# EAGLE design display_test_backup2 (EAGLE 8.1.1)
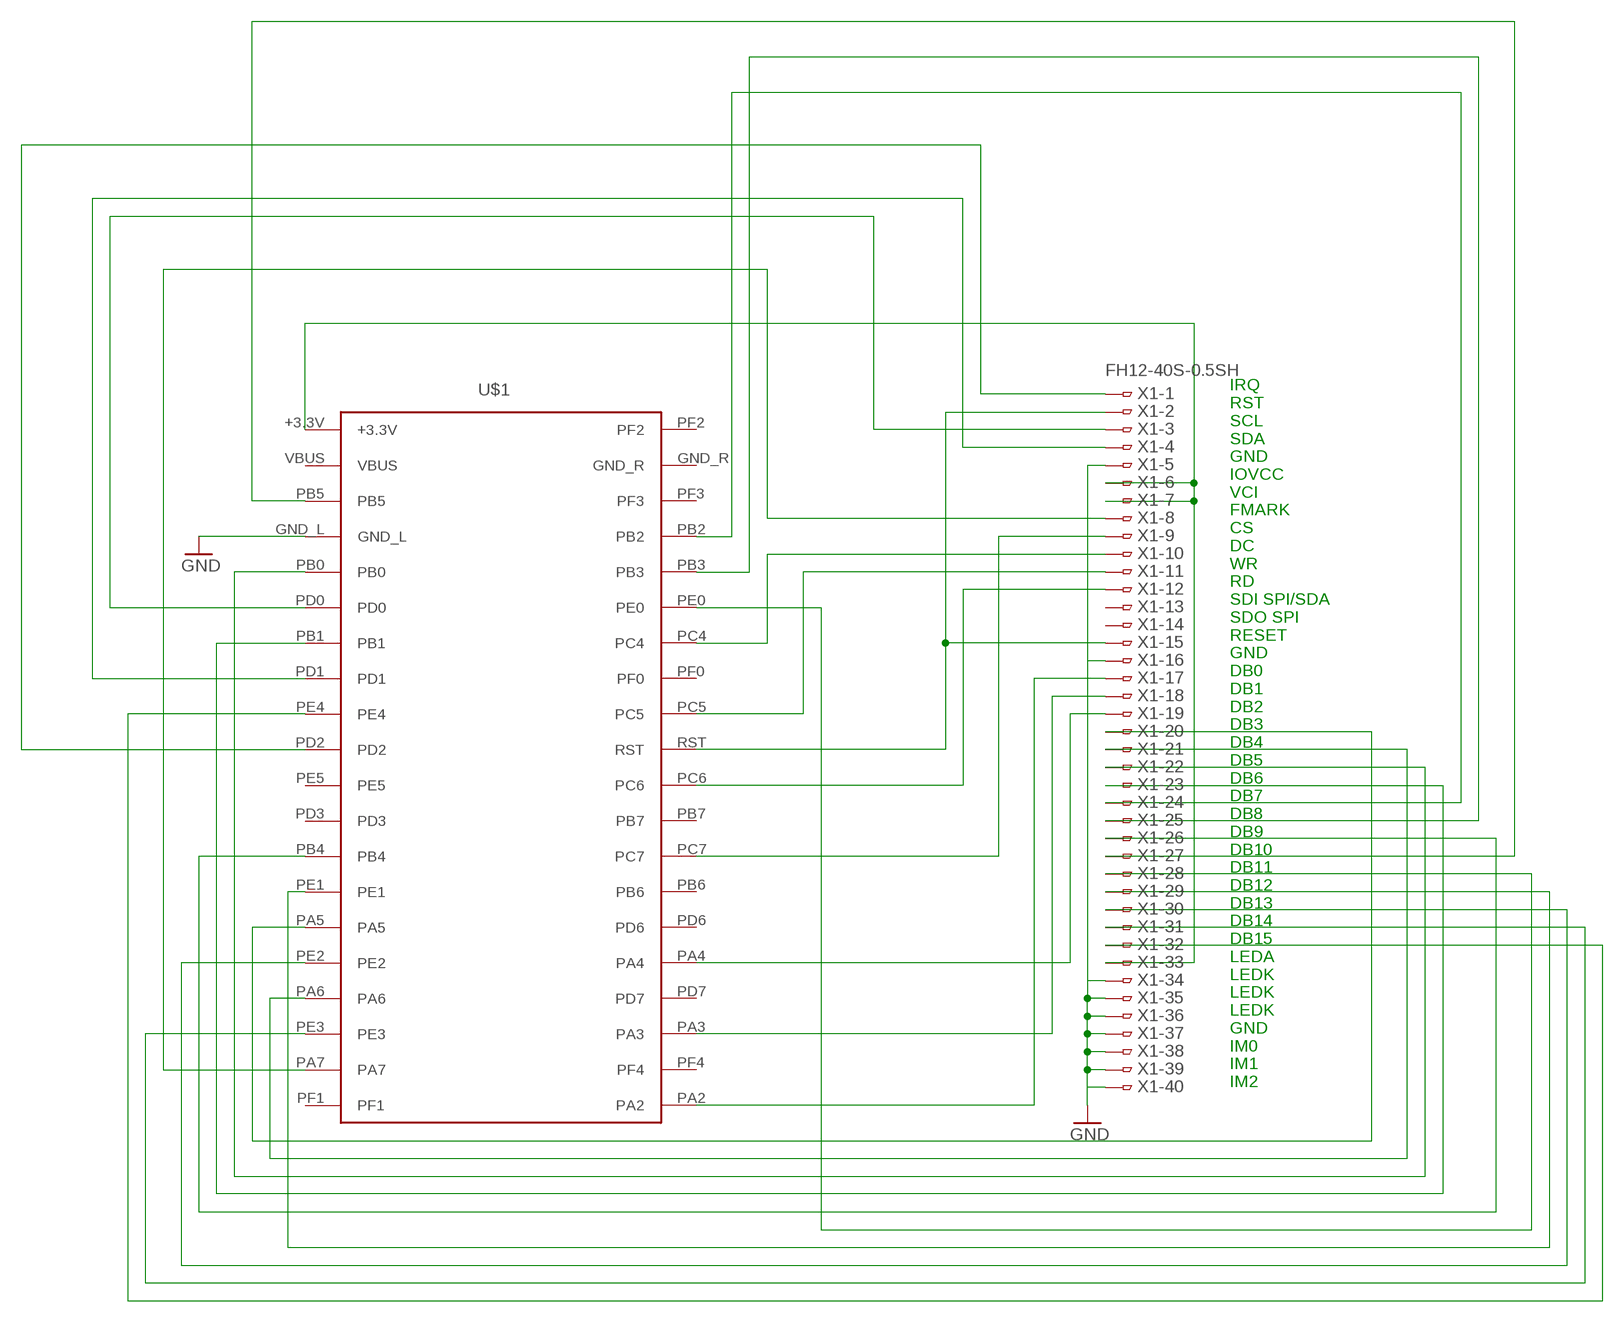
[diagram p0: schematic, sheet 1]

## Parts
U$1  TM4CTM4C  [1_05X2MM]
X1  FH12-40S-0.5SH  [FH12-40S-0.5SH]

## Nets
GND: U$1.GND_L X1.5 X1.16 X1.34 X1.35 X1.36 X1.37 X1.38 X1.39 X1.40
N$1: U$1.+3.3V X1.6 X1.7 X1.33
N$2: U$1.RST X1.2 X1.15
N$3: U$1.PC4 X1.10
N$5: U$1.PC5 X1.11
N$6: U$1.PC6 X1.12
N$7: U$1.PC7 X1.9
N$8: U$1.PA2 X1.17
N$9: U$1.PA7 X1.8
N$10: U$1.PD0 X1.3
N$11: U$1.PD1 X1.4
N$12: U$1.PD2 X1.1
N$13: U$1.PA3 X1.18
N$14: U$1.PA4 X1.19
N$15: U$1.PA5 X1.20
N$16: U$1.PA6 X1.21
N$17: U$1.PB0 X1.22
N$18: U$1.PB1 X1.23
N$19: U$1.PB2 X1.24
N$20: U$1.PB3 X1.25
N$21: U$1.PB4 X1.26
N$22: U$1.PB5 X1.27
N$23: U$1.PE0 X1.28
N$24: U$1.PE1 X1.29
N$25: U$1.PE2 X1.30
N$26: U$1.PE3 X1.31
N$27: U$1.PE4 X1.32
Unconnected: U$1.PB6 U$1.PB7 U$1.PD3 U$1.PD6 U$1.PD7 U$1.PE5 U$1.PF0 U$1.PF1 U$1.PF2 U$1.PF3 U$1.PF4 X1.13 X1.14

## Notes on the sheet
- IRQ
  RST
  SCL
  SDA
  GND
  IOVCC
  VCI
  FMARK
  CS
  DC
  WR
  RD
  SDI SPI/SDA
  SDO SPI
  RESET
  GND
  DB0
  DB1
  DB2
  DB3
  DB4
  DB5
  DB6
  DB7
  DB8
  DB9
  DB10
  DB11
  DB12
  DB13
  DB14
  DB15
  LEDA
  LEDK
  LEDK
  LEDK
  GND
  IM0
  IM1
  IM2

## Power pins joined to a net without a drawn wire
GND_R: U$1.GND_R
VBUS: U$1.VBUS

## Library data of the parts
U$1 = TM4C:TM4C: Tiva TM4C Lauchpad. Untested.
X1 = con-hirose:FH12-40S-0.5S: 0.5mm Pitch Connectors For FPC/FFC Source: Data sheet <http://www.hirose.co.jp/cataloge_hp/e58605370.pdf>; MPN: FH12-40S-0.5SH(55); OC_FARNELL: 1324556; OC_NEWARK: 34M6178

## Board
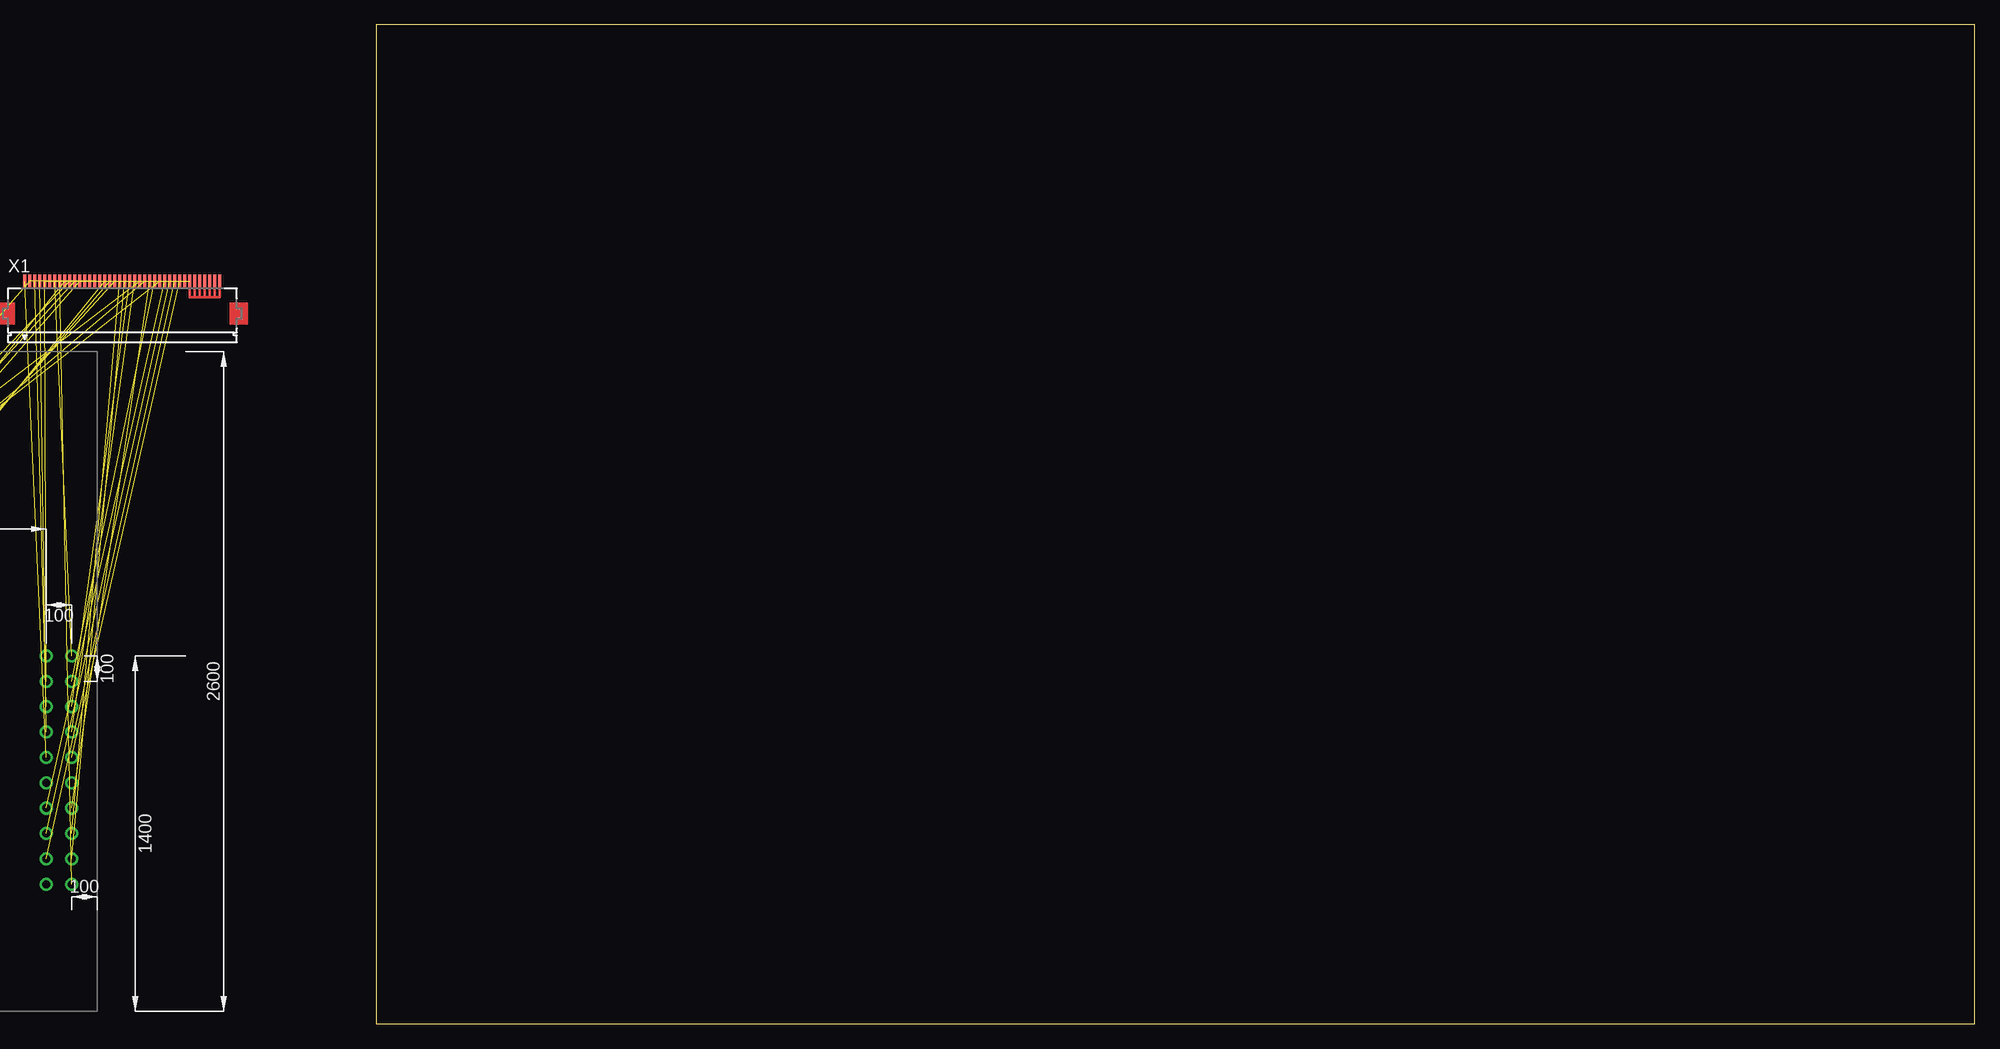
[diagram p1: board, top side]

Size 160 x 100 mm. Coordinates in mm from the lower left corner, seen from the top.
Outline: 0,0 160,0 160,100 0,100 0,0
Copper layers (1*16): Top 0.035mm / dielectric 1.5mm / Bottom 0.035mm
Design rules "default": minimum track width 10mil, minimum drill 24mil, track to track 8mil, track to pad 8mil, pad to pad 8mil, via to via 8mil, smd to smd 8mil, copper to edge 40mil, drill to drill 8mil, minimum pad ring 10mil, minimum via ring 8mil, stop-mask expansion 4mil, vias tented up to drill 0mil, thermal gap 10mil

### Footprints (pad centres in the part's own frame; a part is rotated, then mirrored left to right if it is on the bottom)
1_05X2MM = drill 0.8: +3.3V -7.62,8.89; GND_L -10.16,6.35; GND_R -53.34,8.89; PA2 -53.34,-13.97; PA3 -53.34,-11.43; PA4 -53.34,-8.89; PA5 -7.62,-8.89; PA6 -7.62,-11.43; PA7 -7.62,-13.97; PB0 -7.62,3.81; PB1 -7.62,1.27; PB2 -53.34,6.35; PB3 -50.8,3.81; PB4 -7.62,-6.35; PB5 -7.62,6.35; PB6 -53.34,-6.35; PB7 -53.34,-3.81; PC4 -50.8,1.27; PC5 -50.8,-1.27; PC6 -50.8,-3.81; PC7 -50.8,-6.35; PD0 -10.16,3.81; PD1 -10.16,1.27; PD2 -10.16,-1.27; PD3 -10.16,-3.81; PD6 -50.8,-8.89; PD7 -50.8,-11.43; PE0 -53.34,3.81; PE1 -10.16,-6.35; PE2 -10.16,-8.89; PE3 -10.16,-11.43; PE4 -7.62,-1.27; PE5 -7.62,-3.81; PF0 -53.34,1.27; PF1 -10.16,-13.97; PF2 -50.8,8.89; PF3 -50.8,6.35; PF4 -50.8,-13.97; RST -53.34,-1.27; VBUS -10.16,8.89
FH12-40S-0.5SH = smd 0.3 x 1.3: 1 -9.75,3.25; 2 -9.25,3.25; 3 -8.75,3.25; 4 -8.25,3.25; 5 -7.75,3.25; 6 -7.25,3.25; 7 -6.75,3.25; 8 -6.25,3.25; 9 -5.75,3.25; 10 -5.25,3.25; 11 -4.75,3.25; 12 -4.25,3.25; 13 -3.75,3.25; 14 -3.25,3.25; 15 -2.75,3.25; 16 -2.25,3.25; 17 -1.75,3.25; 18 -1.25,3.25; 19 -0.75,3.25; 20 -0.25,3.25; 21 0.25,3.25; 22 0.75,3.25; 23 1.25,3.25; 24 1.75,3.25; 25 2.25,3.25; 26 2.75,3.25; 27 3.25,3.25; 28 3.75,3.25; 29 4.25,3.25; 30 4.75,3.25; 31 5.25,3.25; 32 5.75,3.25; 33 6.25,3.25; 34 6.75,3.25; 35 7.25,3.25; 36 7.75,3.25; 37 8.25,3.25; 38 8.75,3.25; 39 9.25,3.25; 40 9.75,3.25

### Placement (x,y rotation side)
U$1  -22.86,27.94 0 top  (outside the outline)
X1  -25.4,71.12 0 top  (outside the outline)

### Tracks (layer width: path | path; a pad name or v marks a point on that pad's centre or on a via)
GND  (3 unrouted)
  Top 0.229: X1.40 -15.65,72.77 -16,72.77 | -16,72.77 -16.15,72.77 X1.39 | -16,72.77 -16.65,72.77 | -16.65,72.77 X1.38 | -16.65,72.77 -17.02,72.77 | -17.02,72.77 -17.15,72.77 X1.37 | -17.02,72.77 -17.53,72.77 | -17.53,72.77 -17.65,72.77 X1.36 | -17.53,72.77 -18.03,72.77 | -18.03,72.77 -18.15,72.77 X1.35 | -18.03,72.77 -18.65,72.77 X1.34
N$1  (3 unrouted)
N$2  (2 unrouted)
N$3  (1 unrouted)
N$5  (1 unrouted)
N$6  (1 unrouted)
N$7  (1 unrouted)
N$8  (1 unrouted)
N$9  (1 unrouted)
N$10  (1 unrouted)
N$11  (1 unrouted)
N$12  (1 unrouted)
N$13  (1 unrouted)
N$14  (1 unrouted)
N$15  (1 unrouted)
N$16  (1 unrouted)
N$17  (1 unrouted)
N$18  (1 unrouted)
N$19  (1 unrouted)
N$20  (1 unrouted)
N$21  (1 unrouted)
N$22  (1 unrouted)
N$23  (1 unrouted)
N$24  (1 unrouted)
N$25  (1 unrouted)
N$26  (1 unrouted)
N$27  (1 unrouted)